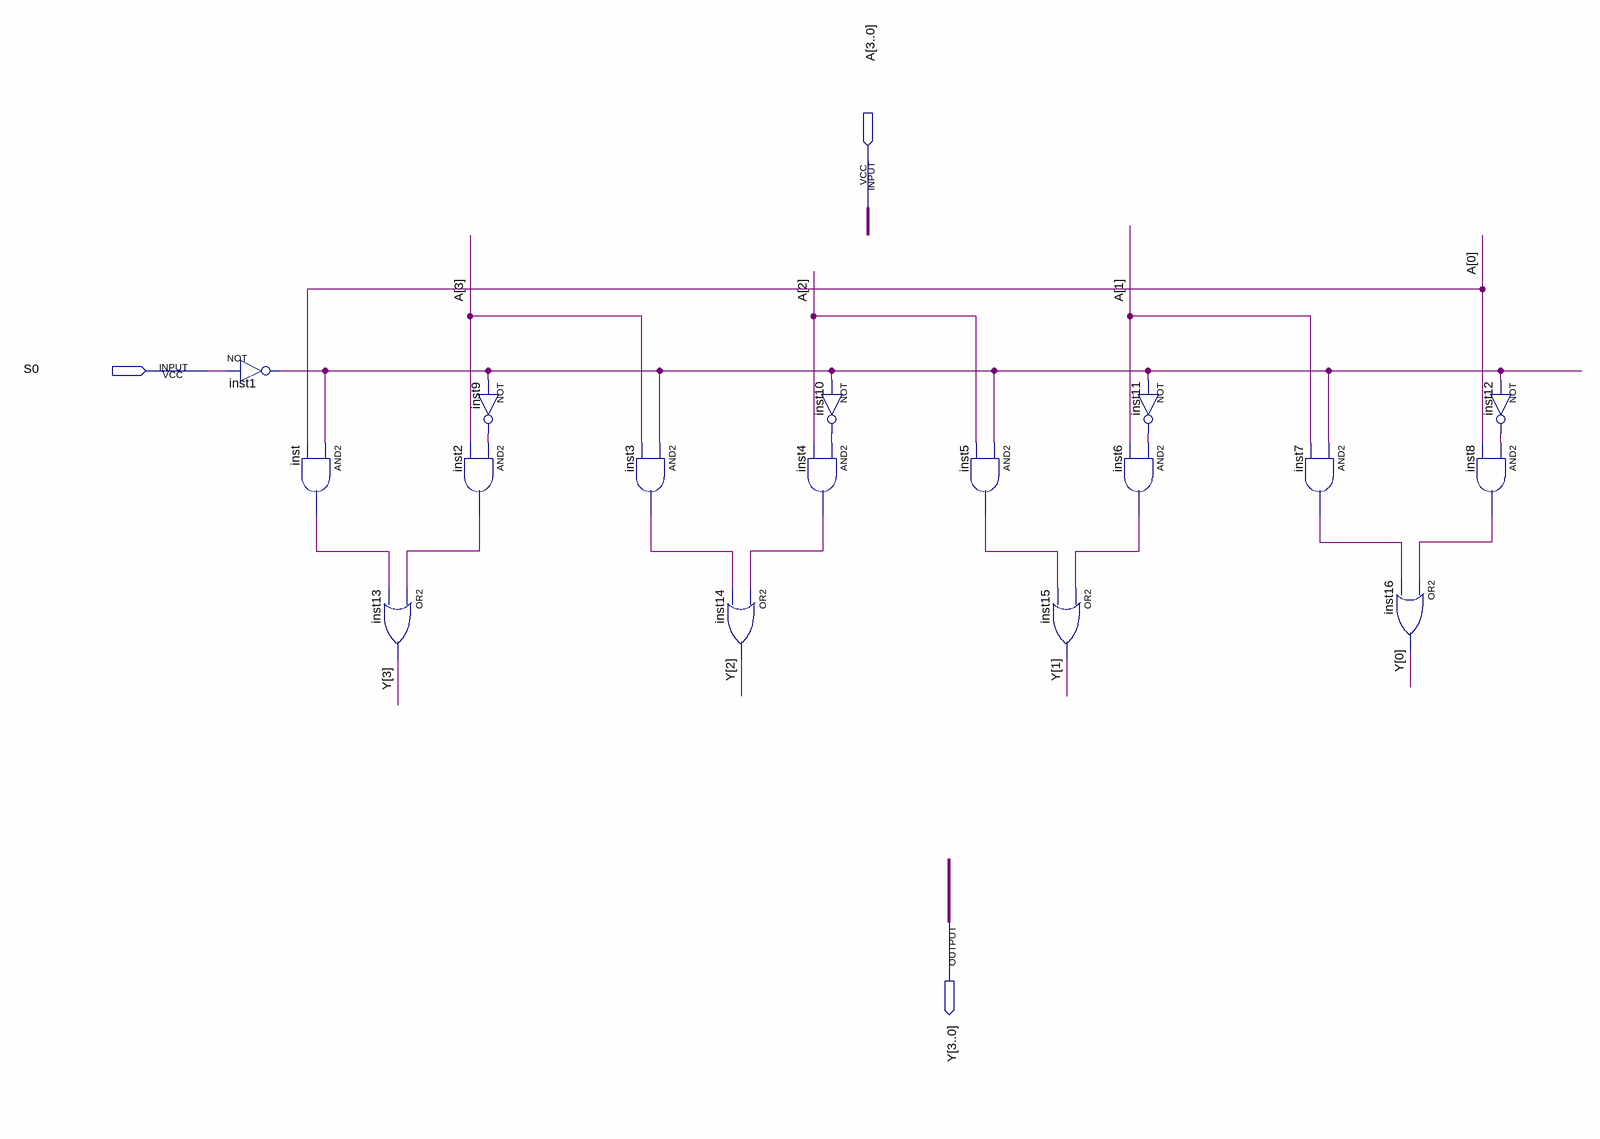
[diagram p0: schematic sheet]
// Quartus schematic RotateRight.bdf as structural Verilog: 17 symbols, 3 pins
module RotateRight (
  input  [3:0] A,
  input  S0,
  output [3:0] Y
);

  wire inst1_out, inst2_out, inst3_out, inst4_out, inst5_out, inst6_out, inst7_out, inst8_out, inst9_out,
       inst10_out, inst11_out, inst12_out, inst_out;

  not inst1 (inst1_out, S0);
  and inst (inst_out, inst1_out, A[0]);
  or inst13 (Y[3], inst2_out, inst_out);
  and inst2 (inst2_out, inst9_out, A[3]);
  not inst9 (inst9_out, inst1_out);
  and inst3 (inst3_out, inst1_out, A[3]);
  or inst14 (Y[2], inst4_out, inst3_out);
  not inst10 (inst10_out, inst1_out);
  and inst4 (inst4_out, inst10_out, A[2]);
  and inst5 (inst5_out, inst1_out, A[2]);
  or inst15 (Y[1], inst6_out, inst5_out);
  and inst6 (inst6_out, inst11_out, A[1]);
  not inst11 (inst11_out, inst1_out);
  and inst7 (inst7_out, inst1_out, A[1]);
  or inst16 (Y[0], inst8_out, inst7_out);
  and inst8 (inst8_out, inst12_out, A[0]);
  not inst12 (inst12_out, inst1_out);
endmodule
